# Altium schematic sheet Sheet1.SchDoc
size A2; SheetNumber: 1; SheetTotal: 1
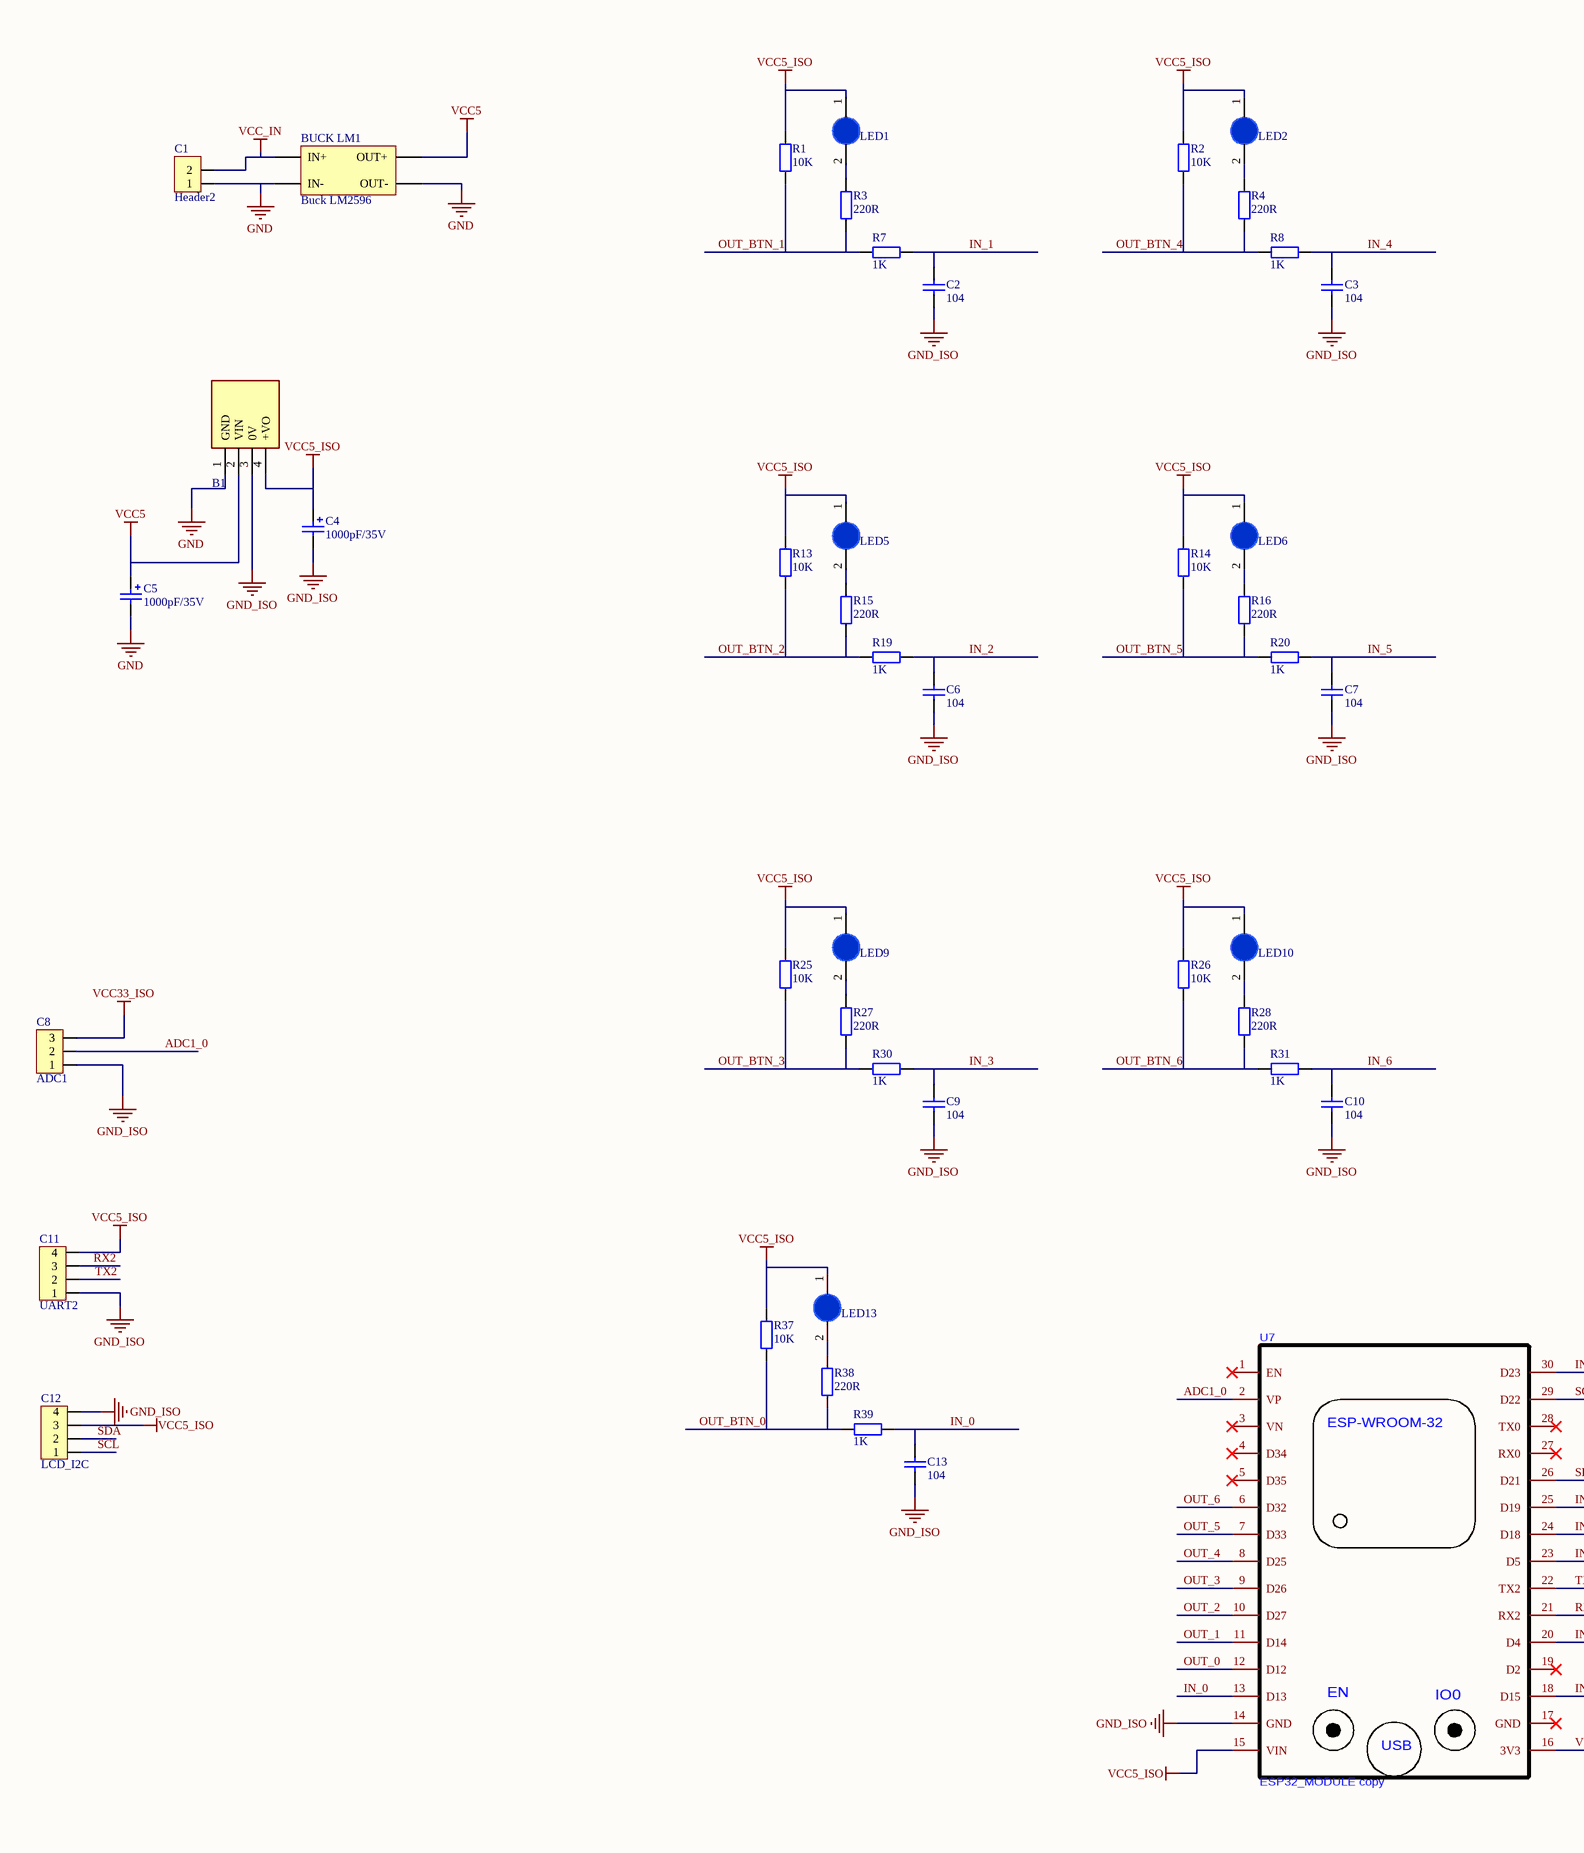
[diagram p0: Sheet1.SchDoc, left]
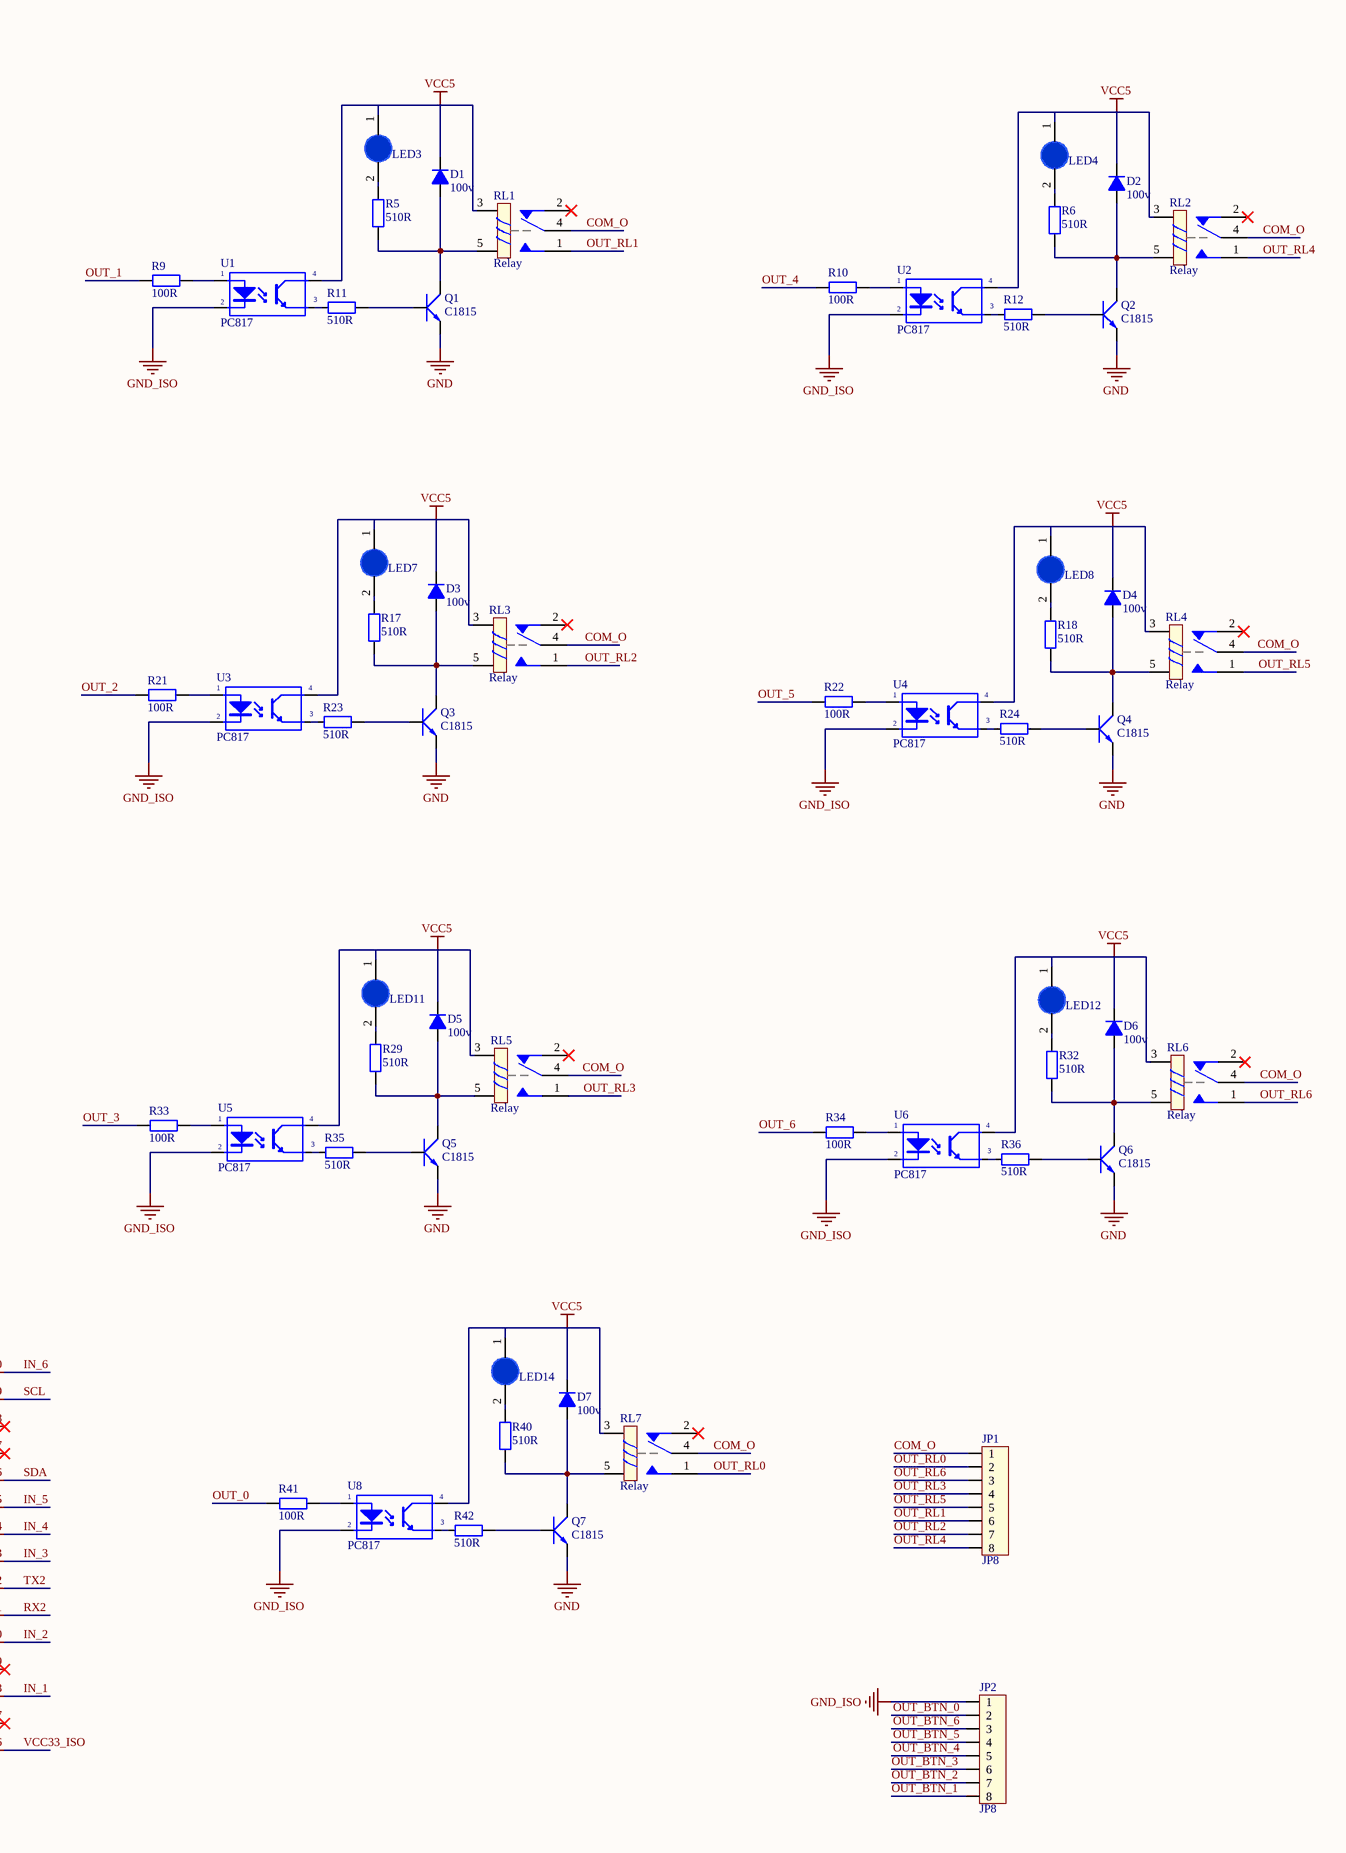
[diagram p1: Sheet1.SchDoc, right]

## Parts
B1  B0505S1W  [B0505S1W]  (value not drawn)
BUCK_LM1  Buck LM2596  [BUCK LM2596]
C1  Header2  [Header2]
C2  104  [tu gom]
C3  104  [tu gom]
C4  value 1000pF/35V  [CP2/5]  (hidden comment: Cap Pol3)
C5  value 1000pF/35V  [CP2/5]  (hidden comment: Cap Pol3)
C6  104  [tu gom]
C7  104  [tu gom]
C8  ADC1  [Header3]
C9  104  [tu gom]
C10  104  [tu gom]
C11  UART2  [Header4]
C12  LCD_I2C  [Header4]
C13  104  [tu gom]
D1  100v  [DIODE 0.5A]
D2  100v  [DIODE 0.5A]
D3  100v  [DIODE 0.5A]
D4  100v  [DIODE 0.5A]
D5  100v  [DIODE 0.5A]
D6  100v  [DIODE 0.5A]
D7  100v  [DIODE 0.5A]
JP1  JP8  [Header8]
JP2  JP8  [Header8]
LED1  LED 3mm  [LED-3MM-BLUE]  (value not drawn)
LED2  LED 3mm  [LED-3MM-BLUE]  (value not drawn)
LED3  LED 3mm  [LED-3MM-BLUE]  (value not drawn)
LED4  LED 3mm  [LED-3MM-BLUE]  (value not drawn)
LED5  LED 3mm  [LED-3MM-BLUE]  (value not drawn)
LED6  LED 3mm  [LED-3MM-BLUE]  (value not drawn)
LED7  LED 3mm  [LED-3MM-BLUE]  (value not drawn)
LED8  LED 3mm  [LED-3MM-BLUE]  (value not drawn)
LED9  LED 3mm  [LED-3MM-BLUE]  (value not drawn)
LED10  LED 3mm  [LED-3MM-BLUE]  (value not drawn)
LED11  LED 3mm  [LED-3MM-BLUE]  (value not drawn)
LED12  LED 3mm  [LED-3MM-BLUE]  (value not drawn)
LED13  LED 3mm  [LED-3MM-BLUE]  (value not drawn)
LED14  LED 3mm  [LED-3MM-BLUE]  (value not drawn)
Q1  C1815  [C1815_cam]
Q2  C1815  [C1815_cam]
Q3  C1815  [C1815_cam]
Q4  C1815  [C1815_cam]
Q5  C1815  [C1815_cam]
Q6  C1815  [C1815_cam]
Q7  C1815  [C1815_cam]
R1  10K  [R1/4W]
R2  10K  [R1/4W]
R3  220R  [R1/4W]
R4  220R  [R1/4W]
R5  510R  [R1/4W]
R6  510R  [R1/4W]
R7  1K  [R1/4W]
R8  1K  [R1/4W]
R9  100R  [R1/4W]
R10  100R  [R1/4W]
R11  510R  [R1/4W]
R12  510R  [R1/4W]
R13  10K  [R1/4W]
R14  10K  [R1/4W]
R15  220R  [R1/4W]
R16  220R  [R1/4W]
R17  510R  [R1/4W]
R18  510R  [R1/4W]
R19  1K  [R1/4W]
R20  1K  [R1/4W]
R21  100R  [R1/4W]
R22  100R  [R1/4W]
R23  510R  [R1/4W]
R24  510R  [R1/4W]
R25  10K  [R1/4W]
R26  10K  [R1/4W]
R27  220R  [R1/4W]
R28  220R  [R1/4W]
R29  510R  [R1/4W]
R30  1K  [R1/4W]
R31  1K  [R1/4W]
R32  510R  [R1/4W]
R33  100R  [R1/4W]
R34  100R  [R1/4W]
R35  510R  [R1/4W]
R36  510R  [R1/4W]
R37  10K  [R1/4W]
R38  220R  [R1/4W]
R39  1K  [R1/4W]
R40  510R  [R1/4W]
R41  100R  [R1/4W]
R42  510R  [R1/4W]
RL1  Relay  [RELAY_SRA_05VDC_SL_C]
RL2  Relay  [RELAY_SRA_05VDC_SL_C]
RL3  Relay  [RELAY_SRA_05VDC_SL_C]
RL4  Relay  [RELAY_SRA_05VDC_SL_C]
RL5  Relay  [RELAY_SRA_05VDC_SL_C]
RL6  Relay  [RELAY_SRA_05VDC_SL_C]
RL7  Relay  [RELAY_SRA_05VDC_SL_C]
U1  PC817  [DIP4/W0.3]
U2  PC817  [DIP4/W0.3]
U3  PC817  [DIP4/W0.3]
U4  PC817  [DIP4/W0.3]
U5  PC817  [DIP4/W0.3]
U6  PC817  [DIP4/W0.3]
U7  ESP32_MODULE copy  [ESP32-WIFIMODULE-FOOTPRINT]
U8  PC817  [DIP4/W0.3]

## Nets
GND: B1.1(GND) BUCK_LM1.2(IN-) BUCK_LM1.3(OUT-) C1.1 C5.2 Q1.1(E) Q2.1(E) Q3.1(E) Q4.1(E) Q5.1(E) Q6.1(E) Q7.1(E)
GND_ISO: B1.3(0V) C2.2 C3.2 C4.2 C6.2 C7.2 C8.1 C9.2 C10.2 C11.1 C12.4 C13.2 JP2.1 U1.2(K) U2.2(K) U3.2(K) U4.2(K) U5.2(K) U6.2(K) U7.14(GND) U8.2(K)
VCC5: B1.2(VIN) BUCK_LM1.4(OUT+) C5.1 D1.2(K) D2.2(K) D3.2(K) D4.2(K) D5.2(K) D6.2(K) D7.2(K) LED3.1(A) LED4.1(A) LED7.1(A) LED8.1(A) LED11.1(A) LED12.1(A) LED14.1(A) RL1.3 RL2.3 RL3.3 RL4.3 RL5.3 RL6.3 RL7.3 U1.4(C) U2.4(C) U3.4(C) U4.4(C) U5.4(C) U6.4(C) U8.4(C)
VCC5_ISO: B1.4(+VO) C4.1 C11.4 C12.3 LED1.1(A) LED2.1(A) LED5.1(A) LED6.1(A) LED9.1(A) LED10.1(A) LED13.1(A) R1.2 R2.2 R13.2 R14.2 R25.2 R26.2 R37.2 U7.15(VIN)
VCC33_ISO: C8.3 U7.16(3V3)
VCC_IN: BUCK_LM1.1(IN+) C1.2
ADC1_0: C8.2 U7.2(VP)
COM_O: JP1.1 RL1.4 RL2.4 RL3.4 RL4.4 RL5.4 RL6.4 RL7.4
IN_0: C13.1 R39.1 U7.13(D13)
IN_1: C2.1 R7.1 U7.18(D15)
IN_2: C6.1 R19.1 U7.20(D4)
IN_3: C9.1 R30.1 U7.23(D5)
IN_4: C3.1 R8.1 U7.24(D18)
IN_5: C7.1 R20.1 U7.25(D19)
IN_6: C10.1 R31.1 U7.30(D23)
OUT_0: R41.1 U7.12(D12)
OUT_1: R9.1 U7.11(D14)
OUT_2: R21.1 U7.10(D27)
OUT_3: R33.1 U7.9(D26)
OUT_4: R10.1 U7.8(D25)
OUT_5: R22.1 U7.7(D33)
OUT_6: R34.1 U7.6(D32)
OUT_BTN_0: JP2.2 R37.1 R38.1 R39.2
OUT_BTN_1: JP2.8 R1.1 R3.1 R7.2
OUT_BTN_2: JP2.7 R13.1 R15.1 R19.2
OUT_BTN_3: JP2.6 R25.1 R27.1 R30.2
OUT_BTN_4: JP2.5 R2.1 R4.1 R8.2
OUT_BTN_5: JP2.4 R14.1 R16.1 R20.2
OUT_BTN_6: JP2.3 R26.1 R28.1 R31.2
OUT_RL0: JP1.2 RL7.1
OUT_RL1: JP1.6 RL1.1
OUT_RL2: JP1.7 RL3.1
OUT_RL3: JP1.4 RL5.1
OUT_RL4: JP1.8 RL2.1
OUT_RL5: JP1.5 RL4.1
OUT_RL6: JP1.3 RL6.1
RX2: C11.3 U7.21(RX2)
SCL: C12.1 U7.29(D22)
SDA: C12.2 U7.26(D21)
TX2: C11.2 U7.22(TX2)
NetD1_1: D1.1(A) Q1.2(C) R5.2 RL1.5
NetD2_1: D2.1(A) Q2.2(C) R6.2 RL2.5
NetD3_1: D3.1(A) Q3.2(C) R17.2 RL3.5
NetD4_1: D4.1(A) Q4.2(C) R18.2 RL4.5
NetD5_1: D5.1(A) Q5.2(C) R29.2 RL5.5
NetD6_1: D6.1(A) Q6.2(C) R32.2 RL6.5
NetD7_1: D7.1(A) Q7.2(C) R40.2 RL7.5
NetLED1_2: LED1.2(K) R3.2
NetLED2_2: LED2.2(K) R4.2
NetLED3_2: LED3.2(K) R5.1
NetLED4_2: LED4.2(K) R6.1
NetLED5_2: LED5.2(K) R15.2
NetLED6_2: LED6.2(K) R16.2
NetLED7_2: LED7.2(K) R17.1
NetLED8_2: LED8.2(K) R18.1
NetLED9_2: LED9.2(K) R27.2
NetLED10_2: LED10.2(K) R28.2
NetLED11_2: LED11.2(K) R29.1
NetLED12_2: LED12.2(K) R32.1
NetLED13_2: LED13.2(K) R38.2
NetLED14_2: LED14.2(K) R40.1
NetQ1_3: Q1.3(B) R11.2
NetQ2_3: Q2.3(B) R12.2
NetQ3_3: Q3.3(B) R23.2
NetQ4_3: Q4.3(B) R24.2
NetQ5_3: Q5.3(B) R35.2
NetQ6_3: Q6.3(B) R36.2
NetQ7_3: Q7.3(B) R42.2
NetR9_2: R9.2 U1.1(A)
NetR10_2: R10.2 U2.1(A)
NetR11_1: R11.1 U1.3(E)
NetR12_1: R12.1 U2.3(E)
NetR21_2: R21.2 U3.1(A)
NetR22_2: R22.2 U4.1(A)
NetR23_1: R23.1 U3.3(E)
NetR24_1: R24.1 U4.3(E)
NetR33_2: R33.2 U5.1(A)
NetR34_2: R34.2 U6.1(A)
NetR35_1: R35.1 U5.3(E)
NetR36_1: R36.1 U6.3(E)
NetR41_2: R41.2 U8.1(A)
NetR42_1: R42.1 U8.3(E)

Not connected (* = marked no-connect by the designer): RL1 2*; RL2 2*; RL3 2*; RL4 2*; RL5 2*; RL6 2*; RL7 2*; U7 1(EN)* 3(VN)* 4(D34)* 5(D35)* 17(GND)* 19(D2)* 27(RX0)* 28(TX0)*

## Notes on the sheet
- (in symbol ESP32_MODULE copy) ESP-WROOM-32; IO0; USB

## Library data of the parts
B1 = B0505S1W: Power Supply; Manufacturer_Name: Mornsun; Manufacturer_Part_Number: B0505S-1W; Datasheet Link: https://www.mornsun-power.com/uploads/pdf/B_D-1W.pdf; Height: 10.41mm
C1 = Header2: Header IDC, 2 x 1 Pin Vertical 2.54mm Pitch (Non-Boxed, Male); Manufacturer: W¨¹rth Elektronik eiSos GmbH; partNo: 613002143121; ComponentLink1 Description: Manufacturer; ComponentLink2 Description: Datasheet; NoPins: 02; Created Date: 29 March 2013; ComponentLink1URL: http://www.we-online.com; ComponentLink2URL: http://katalog.we-online.de/em/datasheet/6130xx143121.pdf; Created by: Karrer Zheng
C2 C3 C6 C7 C9 C10 C13 = Tu gom 104 50V: Cắm; So_Chan: 2; Ten_Linh_Kien: Tụ gốm 104 100nF 50V; Don_Vi: Con; Ma_Hang: MH004761; Chung_Loai: Cắm; Kieu_Chan: *
C4 C5 = Cap Pol3: Polarized Capacitor (Surface Mount); VALUE: C?; LatestRevisionDate: 17-Jul-2002; LatestRevisionNote: Re-released for DXP Platform.; PackageReference: C0805; Publisher: Altium Limited
C8 = Header3: Header IDC, 3 x 1 Pin Vertical 2.54mm Pitch (Non-Boxed, Male); Manufacturer: W¨¹rth Elektronik eiSos GmbH; partNo: 613002143121; ComponentLink1 Description: Manufacturer; ComponentLink2 Description: Datasheet; NoPins: 02; Created Date: 29 March 2013; ComponentLink1URL: http://www.we-online.com; ComponentLink2URL: http://katalog.we-online.de/em/datasheet/6130xx143121.pdf; Created by: Karrer Zheng
C11 C12 = Header4: Header IDC, 4 x 1 Pin Vertical 2.54mm Pitch (Non-Boxed, Male); Manufacturer: W¨¹rth Elektronik eiSos GmbH; partNo: 613002143121; ComponentLink1 Description: Manufacturer; ComponentLink2 Description: Datasheet; NoPins: 02; Created Date: 29 March 2013; ComponentLink1URL: http://www.we-online.com; ComponentLink2URL: http://katalog.we-online.de/em/datasheet/6130xx143121.pdf; Created by: Karrer Zheng
D1-D7 = Diode 1N4148: Cắm; Ten_Linh_Kien: Diode 1N4148 DO35 450mA 100V ( 1N4148 DIP); Don_Vi: Con; Ma_Hang: MH001065; Ghi Chu: *; Kieu_Chan: *; Chung_Loai: Cắm
JP1 JP2 = Header8: Connector 8; Value: Connector 8
LED1-LED14 = LED 3mm Xanh Duong: Cắm; Don_Vi: Con; Ma_Hang: MH009003; Ten_Linh_Kien: LED 3MM Xanh Dương SS (1000c); Ghi_Chu: *; Kieu_Chan: *; Chung_Loai: Cắm
Q1-Q7 = C1815: NPN 600mW, ECB; Value: C1815
R1-R42 = R1/4W: Resistor 1/4W; Value: R1/4W - 1K
RL1-RL7 = RL_SRA-05VDC-SL-C: Relay 5 Chan; Ma_Hang: MH009374; Ten: Relay 5V10A SRD-05VDC-SL-C Chính Hãng
U1-U6 U8 = PC817: Single Opto; Value: PC817